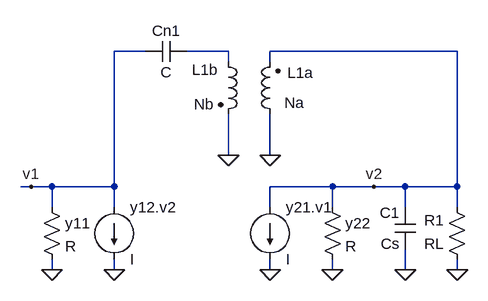
[diagram p0: schematic circuito_AC_a.asc]
circuito_AC_a.asc, the LTspice schematic file:
Version 4
SHEET 1 880 680
WIRE -272 -208 -320 -208
WIRE -144 -208 -208 -208
WIRE 208 -208 -80 -208
WIRE -144 -192 -144 -208
WIRE -80 -192 -80 -208
WIRE -144 -48 -144 -112
WIRE -80 -48 -80 -112
WIRE -448 0 -464 0
WIRE -416 0 -448 0
WIRE -320 0 -320 -208
WIRE -320 0 -416 0
WIRE 16 0 -80 0
WIRE 80 0 16 0
WIRE 128 0 80 0
WIRE 208 0 208 -208
WIRE 208 0 128 0
WIRE -416 32 -416 0
WIRE -320 32 -320 0
WIRE -80 32 -80 0
WIRE 16 32 16 0
WIRE 128 32 128 0
WIRE 208 32 208 0
WIRE -416 128 -416 112
WIRE -320 128 -320 112
WIRE -80 128 -80 112
WIRE 16 128 16 112
WIRE 128 128 128 96
WIRE 208 128 208 112
FLAG -80 128 0
FLAG -320 128 0
FLAG -144 -48 0
FLAG -80 -48 0
FLAG 208 128 0
FLAG -416 128 0
FLAG 16 128 0
FLAG 128 128 0
FLAG 80 0 v2
FLAG -448 0 v1
SYMBOL ind2 -64 -96 R180
WINDOW 0 -51 79 Left 2
WINDOW 3 -37 33 Left 2
SYMATTR InstName L1a
SYMATTR Value Na
SYMATTR Type ind
SYMBOL ind2 -160 -208 R0
WINDOW 0 -40 28 Left 2
WINDOW 3 -37 81 Left 2
SYMATTR InstName L1b
SYMATTR Value Nb
SYMATTR Type ind
SYMBOL cap -272 -192 R270
WINDOW 0 32 32 VTop 2
WINDOW 3 0 32 VBottom 2
SYMATTR InstName Cn1
SYMBOL cap 144 96 R180
WINDOW 0 24 56 Left 2
WINDOW 3 24 8 Left 2
SYMATTR InstName C1
SYMATTR Value Cs
SYMBOL res 224 128 R180
WINDOW 0 36 76 Left 2
WINDOW 3 36 40 Left 2
SYMATTR InstName R1
SYMATTR Value RL
SYMBOL current -80 32 R0
SYMATTR InstName y21.v1
SYMBOL current -320 32 R0
SYMATTR InstName y12.v2
SYMBOL res 0 16 R0
SYMATTR InstName y22
SYMBOL res -432 16 R0
SYMATTR InstName y11

The netlist it stands for:
* circuito_AC_a.asc
L1a 0 v2 Na
L1b N001 0 Nb
Cn1 v1 N001 C
C1 0 v2 Cs
R1 0 v2 RL
I§y21.v1 v2 0 I
I§y12.v2 v1 0 I
R§y22 v2 0 R
R§y11 v1 0 R
.backanno
.end